# EAGLE design preamp_v2 (EAGLE 8.7.1)
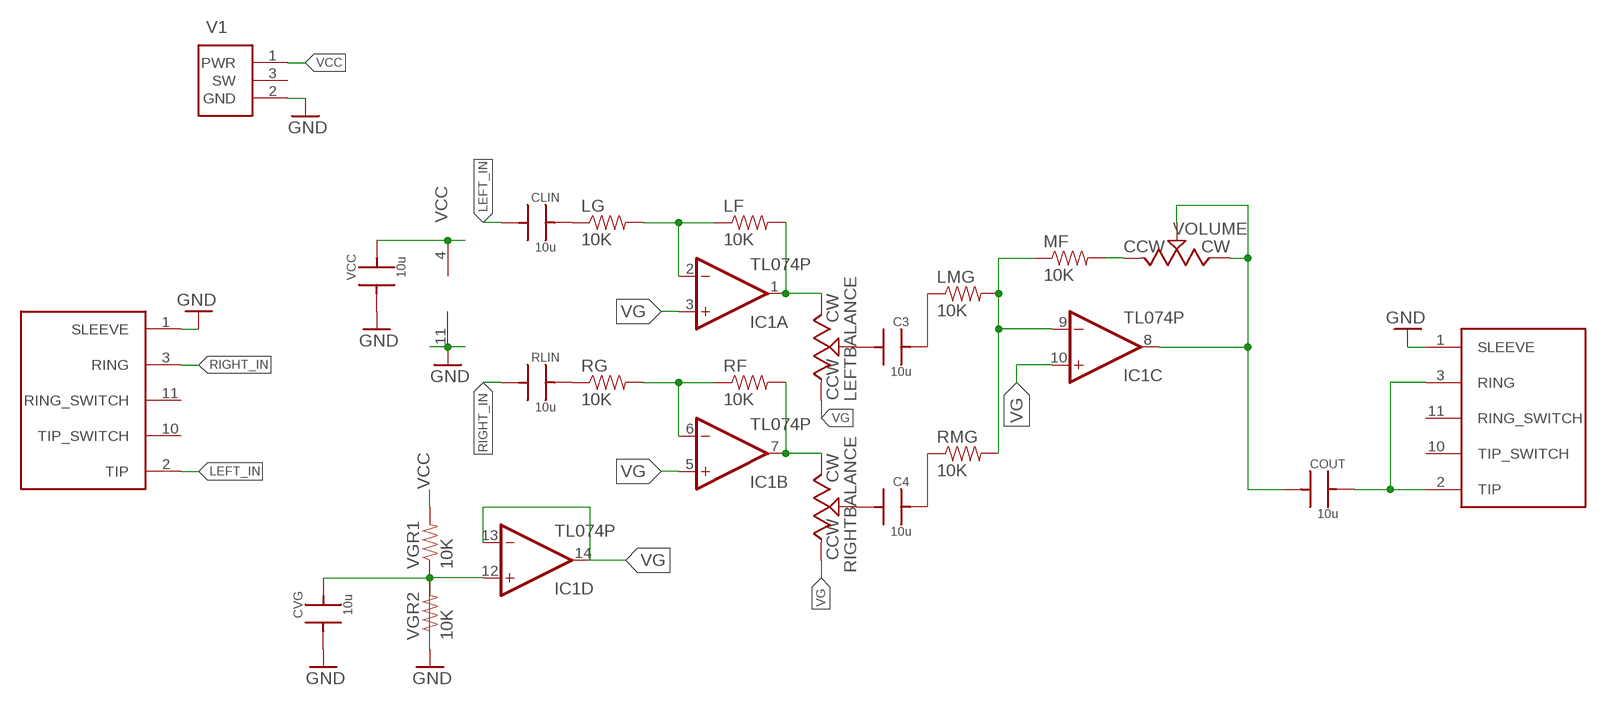
[diagram p0: schematic, sheet 1]

## Parts
C3  10u  CAP  [C322]
C4  10u  CAP  [C322]
CLIN  10u  CAP  [C322]
COUT  10u  CAP  [C322]
CVG  10u  CAP  [C322]
IC1  TL074P  [DIL14]
LEFTBALANCE  POTENTIOMETER3362P  [3362P]
LF  10K  RESISTORPTH-1/4W  [AXIAL-0.4]
LG  10K  RESISTORPTH-1/4W  [AXIAL-0.4]
LMG  10K  RESISTORPTH-1/4W  [AXIAL-0.4]
MF  10K  RESISTORPTH-1/4W  [AXIAL-0.4]
RF  10K  RESISTORPTH-1/4W  [AXIAL-0.4]
RG  10K  RESISTORPTH-1/4W  [AXIAL-0.4]
RIGHTBALANCE  POTENTIOMETER3362P  [3362P]
RLIN  10u  CAP  [C322]
RMG  10K  RESISTORPTH-1/4W  [AXIAL-0.4]
U$3  AUDIO_5_CONDUCTOR  [SJ1-3525N]
U$4  AUDIO_5_CONDUCTOR  [SJ1-3525N]
V1  POWER_JACK  [PJ-102AH]
VCC  10u  CAP  [C322]
VGR1  10K  RESISTORPTH-1/4W  [AXIAL-0.4]
VGR2  10K  RESISTORPTH-1/4W  [AXIAL-0.4]
VOLUME  POTENTIOMETER3362P  [3362P]

## Nets
GND: CVG.1 IC1.11(P:V-) U$3.1(SLEEVE) U$4.1(SLEEVE) V1.2(GND) VCC.1 VGR2.P$2
LEFT_IN: CLIN.1 U$3.2(TIP)
N$1: IC1.2(A:-IN) LF.P$1 LG.P$2
N$2: IC1.6(B:-IN) RF.P$1 RG.P$2
N$3: IC1.7(B:OUT) RF.P$2 RIGHTBALANCE.3(CW)
N$4: IC1.1(A:OUT) LEFTBALANCE.3(CW) LF.P$2
N$5: RG.P$1 RLIN.2
N$6: CLIN.2 LG.P$1
N$7: CVG.2 IC1.12(D:+IN) VGR1.P$1 VGR2.P$1
N$8: C3.1 LEFTBALANCE.2(WIPER)
N$9: C3.2 LMG.P$1
N$10: C4.2 RMG.P$1
N$11: IC1.9(C:-IN) LMG.P$2 MF.P$1 RMG.P$2
N$12: C4.1 RIGHTBALANCE.2(WIPER)
N$13: COUT.1 IC1.8(C:OUT) VOLUME.2(WIPER) VOLUME.3(CW)
N$14: COUT.2 U$4.2(TIP) U$4.3(RING)
N$15: MF.P$2 VOLUME.1(CCW)
RIGHT_IN: RLIN.1 U$3.3(RING)
VCC: IC1.4(P:V+) V1.1(PWR) VCC.2 VGR1.P$2
VG: IC1.3(A:+IN) IC1.5(B:+IN) IC1.10(C:+IN) IC1.13(D:-IN) IC1.14(D:OUT) LEFTBALANCE.1(CCW) RIGHTBALANCE.1(CCW)
Unconnected: U$3.10(TIP_SWITCH) U$3.11(RING_SWITCH) U$4.10(TIP_SWITCH) U$4.11(RING_SWITCH)

## Power pins joined to a net without a drawn wire
SW: V1.3(SW)

## Library data of the parts
C3 C4 CLIN COUT CVG RLIN VCC = KEMET:CAP
IC1 = linear:TL074: OP AMP
LEFTBALANCE RIGHTBALANCE VOLUME = Bourns:POTENTIOMETER
LF LG LMG MF RF RG RMG VGR1 VGR2 = SparkFun-Passives:RESISTOR: Resistor Basic schematic elements and footprints for 0603, 1206, and PTH resistors.
U$3 U$4 = CUI:AUDIO_5_CONDUCTOR
V1 = CUI:POWER_JACK: Standard Power Jack with Switch

## Net classes
0 default: width 0.406 mm

## Board
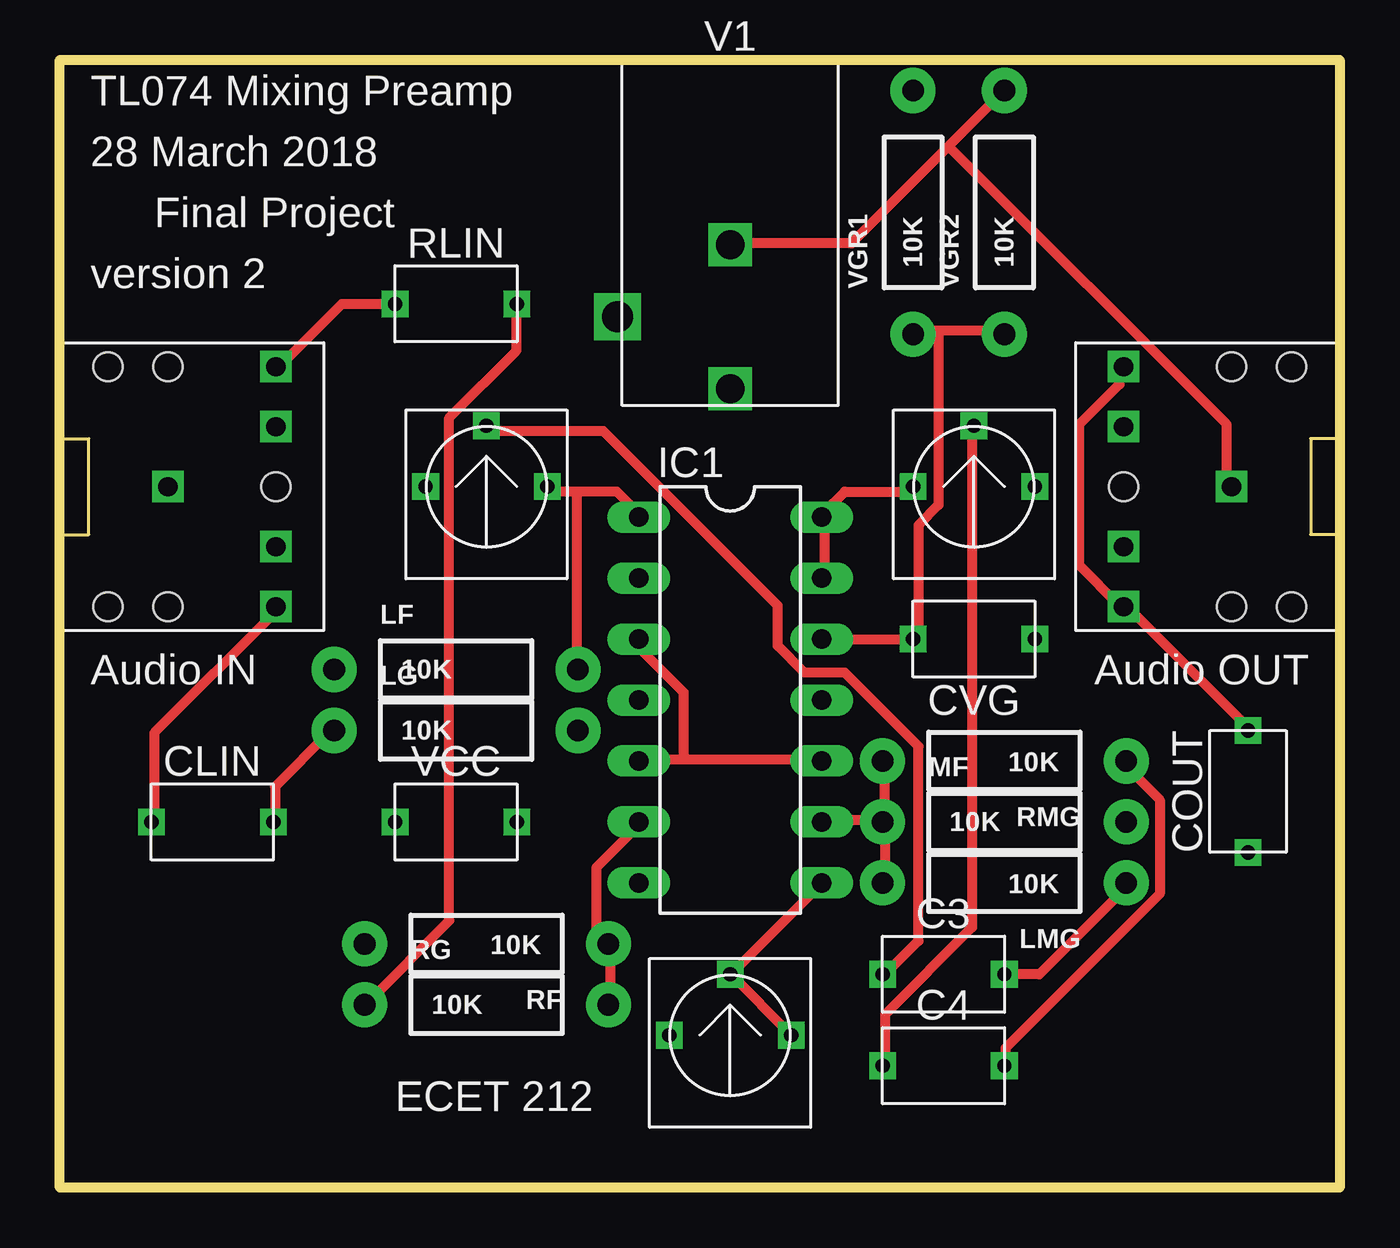
[diagram p1: board, top side]
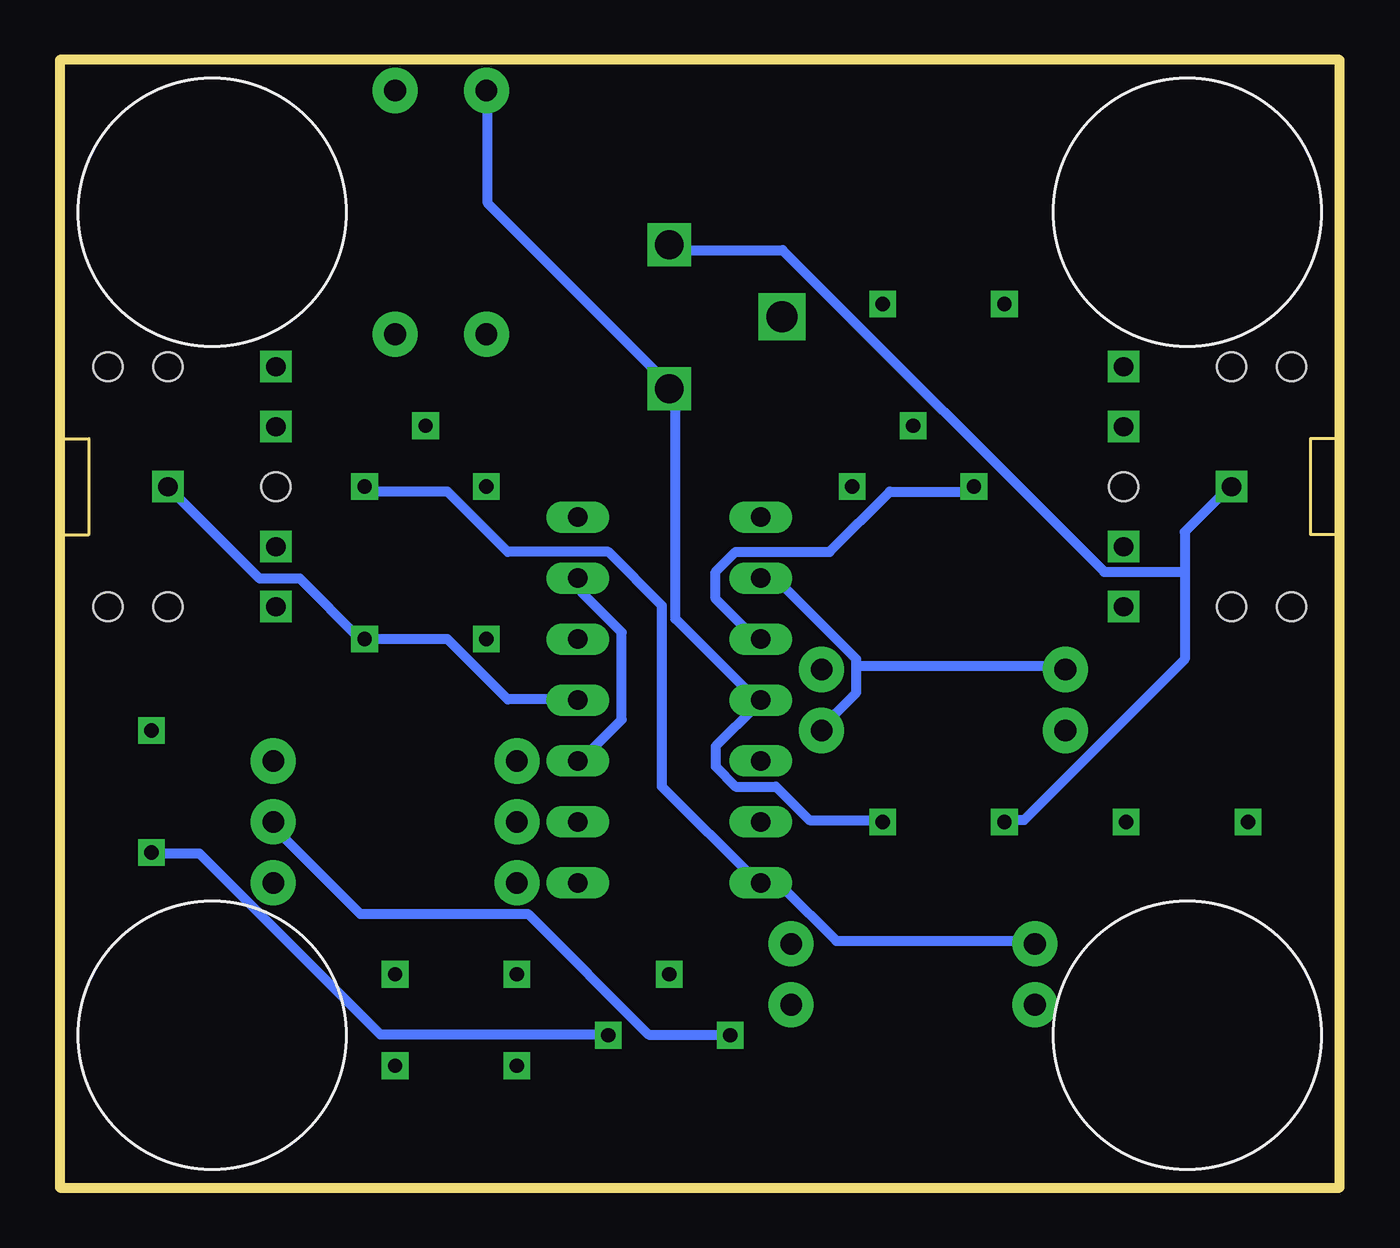
[diagram p2: board, bottom side, seen from below]

Size 53.34 x 46.99 mm. Coordinates in mm from the lower left corner, seen from the top.
Outline: 0,0 0,46.99 53.34,46.99 53.34,0 0,0
Copper layers (1*16): Top 0.035mm / dielectric 1.5mm / Bottom 0.035mm
Design rules "default": minimum track width 6mil, minimum drill 0.35mm, track to track 6mil, track to pad 6mil, pad to pad 6mil, via to via 6mil, smd to smd 6mil, copper to edge 40mil, drill to drill 6mil, minimum pad ring 10mil, minimum via ring 8mil, stop-mask expansion 4mil, vias tented up to drill 0mil, thermal gap 10mil

### Footprints (pad centres in the part's own frame; a part is rotated, then mirrored left to right if it is on the bottom)
C322 = drill 0.6 square: 1 -2.54,0; 2 2.54,0
DIL14 = drill 0.813 long: 1 -7.62,-3.81; 2 -5.08,-3.81; 3 -2.54,-3.81; 4 0,-3.81; 5 2.54,-3.81; 6 5.08,-3.81; 7 7.62,-3.81; 8 7.62,3.81; 9 5.08,3.81; 10 2.54,3.81; 11 0,3.81; 12 -2.54,3.81; 13 -5.08,3.81; 14 -7.62,3.81
3362P = drill 0.6 square: 1 -2.54,0; 2 0,2.54; 3 2.54,0
AXIAL-0.4 = drill 0.9 pad 1.88: P$1 -5.08,0; P$2 5.08,0
SJ1-3525N = drill 0.8 square: 1 0,-4.5; 2 -5,-9; 3 5,-9; 10 -2.5,-9; 11 2.5,-9 | hole 1.2: -5,-2; 5,-2; -5,-4.5; 5,-4.5; 0,-9
PJ-102AH = drill 1.2 square: 1 0,-13.7; 2 0,-7.7 | drill 1.3 square: 3 -4.7,-10.7

### Placement (x,y rotation side)
C3  36.83,8.89 0 top
C4  36.83,5.08 0 top
CLIN  6.35,15.24 0 top
COUT  49.53,16.51 90 top
CVG  38.1,22.86 180 top
IC1  27.94,20.32 270 top
LEFTBALANCE  17.78,29.21 0 top
LF  16.51,21.59 0 top
LG  16.51,19.05 0 top
LMG  39.37,12.7 180 top
MF  39.37,15.24 0 top
RF  17.78,10.16 180 top
RG  17.78,7.62 0 top
RIGHTBALANCE  38.1,29.21 0 top
RLIN  16.51,36.83 0 top
RMG  39.37,17.78 180 top
U$3  0,29.21 90 top
U$4  53.34,29.21 270 top
U$7  [SJ-5003]  46.99,40.64 0 bottom
U$8  [SJ-5003]  46.99,6.35 0 bottom
U$9  [SJ-5003]  6.35,40.64 0 bottom
U$10  [SJ-5003]  6.35,6.35 0 bottom
V1  27.94,46.99 0 top
VCC  16.51,15.24 0 top
VGR1  35.56,40.64 90 top
VGR2  39.37,40.64 90 top
VOLUME  27.94,6.35 0 top

### Tracks (layer width: path | path; a pad name or v marks a point on that pad's centre or on a via)
GND
  Top 0.406: VGR2.P$2 37.05,43.4 | 37.05,43.4 32.99,39.34 27.96,39.34 V1.2 | 37.05,43.4 48.64,31.8 48.64,29.29 U$4.1
  Bottom 0.406: 6.45,25.65 6.45,27.33 4.78,29.01 U$3.1 | 6.45,25.65 6.45,22.02 13.16,15.32 13.72,15.32 VCC.1 | IC1.11 31.88,20.34 34.67,20.34 37.19,22.86 CVG.1 40.82,22.86 43.33,25.38 45.01,25.38 48.64,29.01 U$4.1 | 6.45,25.65 9.8,25.65 23.22,39.06 27.69,39.06 V1.2
LEFT_IN
  Top 0.406: CLIN.1 3.94,15.32 3.94,18.95 8.97,23.98 U$3.2
N$1
  Bottom 0.406: 20.14,21.74 20.14,20.62 21.54,19.23 LG.P$2 | 20.14,21.74 20.14,22.02 23.49,25.38 24.05,25.38 IC1.2 | 20.14,21.74 11.48,21.74 LF.P$1
N$2
  Top 0.406: IC1.6 24.05,15.04 22.38,13.36 22.38,10.57 22.66,10.29 RF.P$1 22.94,10.01 22.94,7.77 RG.P$2
N$3
  Bottom 0.406: RIGHTBALANCE.3 40.54,29.01 37.19,29.01 34.67,26.49 30.48,26.49 28.24,24.26 28.24,16.71 24.33,12.8 IC1.7 24.05,12.52 23.22,12.52 20.98,10.29 12.88,10.29 RF.P$2
N$4
  Top 0.406: 21.54,29.01 23.22,29.01 24.05,28.17 IC1.1 | 21.54,29.01 20.42,29.01 LEFTBALANCE.3 | 21.54,29.01 21.54,21.74 LF.P$2
N$5
  Top 0.406: RLIN.2 19.02,36.83 19.02,34.87 16.23,32.08 16.23,11.12 12.88,7.77 RG.P$1
N$6
  Top 0.406: CLIN.2 8.97,15.32 8.97,16.71 11.2,18.95 LG.P$1
N$7
  Top 0.406: IC1.12 CVG.2 35.79,22.86 35.79,27.61 36.63,28.45 36.63,35.71 | 36.63,35.71 39.14,35.71 VGR2.P$1 | 36.63,35.71 35.79,35.71 VGR1.P$1
N$8
  Top 0.406: LEFTBALANCE.2 17.91,31.52 22.66,31.52 29.92,24.26 29.92,22.58 31.04,21.46 32.72,21.46 35.79,18.39 35.79,10.29 34.39,8.89 C3.1
N$9
  Top 0.406: C3.2 40.82,8.89 44.45,12.52 LMG.P$1
N$10
  Top 0.406: C4.2 39.42,5.26 39.42,5.82 45.85,12.24 45.85,16.15 44.45,17.55 RMG.P$1
N$11
  Top 0.406: IC1.9 31.88,15.32 34.11,15.32 MF.P$1 | LMG.P$2 34.39,12.8 34.39,15.04 MF.P$1 | RMG.P$2 34.39,17.55 34.39,15.32 MF.P$1
N$12
  Top 0.406: C4.1 34.39,5.26 34.39,7.21 38.02,10.85 38.02,31.52 RIGHTBALANCE.2
N$13
  Top 0.406: 27.96,8.89 30.48,6.38 VOLUME.3 | 27.96,8.89 31.6,12.52 IC1.8 | 27.96,8.89 VOLUME.2
  Bottom 0.406: COUT.1 49.48,13.92 47.52,13.92 39.98,6.38 30.48,6.38 VOLUME.3
N$14
  Top 0.406: U$4.2 44.17,34.04 44.17,33.48 42.49,31.8 42.49,25.93 44.17,24.26 U$4.3 44.45,24.26 49.48,19.23 COUT.2
N$15
  Bottom 0.406: VOLUME.1 25.45,6.38 28.8,6.38 33.83,11.4 40.82,11.4 44.45,15.04 MF.P$2
RIGHT_IN
  Top 0.406: RLIN.1 11.76,36.83 9.25,34.31 U$3.3
VCC
  Bottom 0.406: VCC.2 19.3,15.32 22.1,15.32 23.49,16.71 25.17,16.71 26.01,17.55 26.01,18.39 24.33,20.07 IC1.4 24.33,20.34 27.69,23.7 27.69,33.2 V1.1 27.96,33.48 35.51,41.02 35.51,45.49 VGR1.P$2
VG
  Top 0.406: RIGHTBALANCE.1 35.51,29.01 32.72,29.01 31.88,28.17 IC1.14 31.88,27.89 31.88,25.65 IC1.13 | 26.01,17.83 31.6,17.83 IC1.10 | 26.01,17.83 24.33,17.83 IC1.5 | 26.01,17.83 26.01,20.62 24.33,22.3 24.33,22.86 IC1.3
  Bottom 0.406: LEFTBALANCE.1 15.39,29.01 18.74,29.01 21.26,26.49 25.17,26.49 26.01,25.65 26.01,24.54 24.33,22.86 IC1.3 | IC1.13 31.6,25.38 31.6,24.82 29.92,23.14 29.92,19.51 31.6,17.83 IC1.10

### Text on the board
tPlace: TL074 Mixing Preamp | 28 March 2018 | Final Project | version 2 | Audio IN | Audio OUT | ECET 212